# EAGLE design PureRingMod (EAGLE 9.2.2)

## Sheet 1 of 2: Main
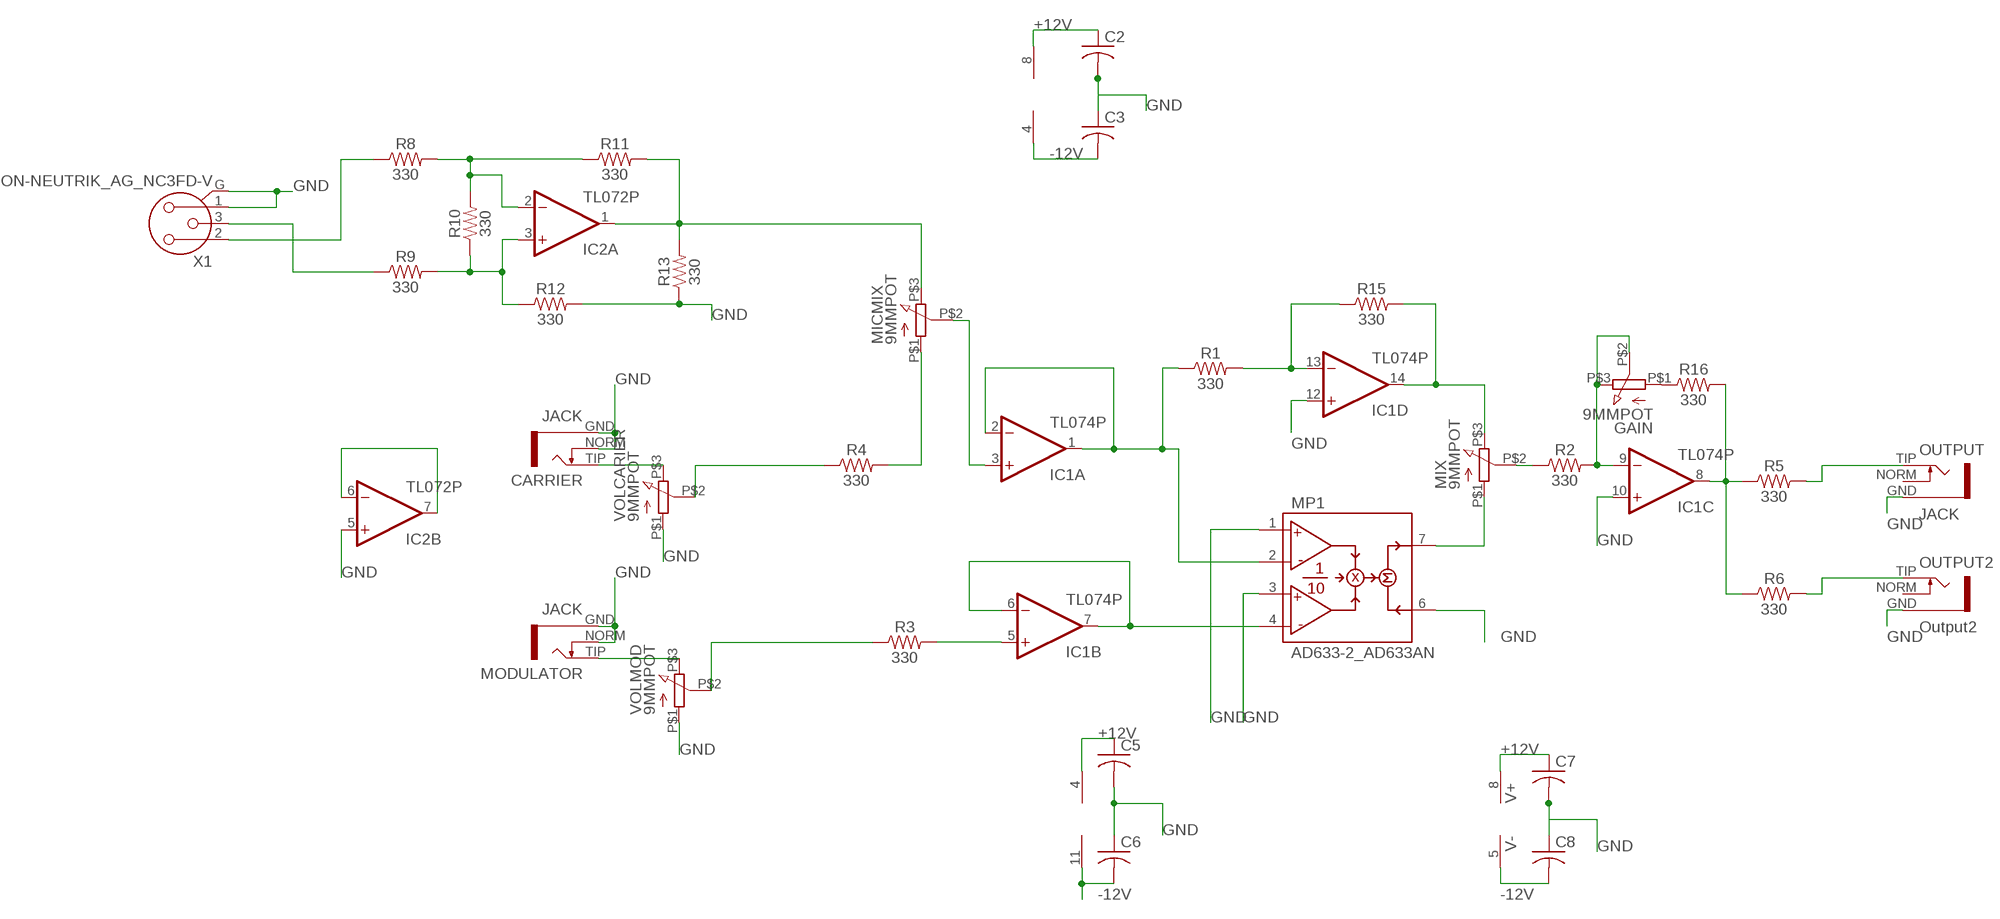
[diagram p0: schematic, sheet 1]

### Parts
C2  CAPACITOR-US050-025X075  [C050-025X075]
C3  CAPACITOR-US050-025X075  [C050-025X075]
C5  CAPACITOR-US050-025X075  [C050-025X075]
C6  CAPACITOR-US050-025X075  [C050-025X075]
C7  CAPACITOR-US050-025X075  [C050-025X075]
C8  CAPACITOR-US050-025X075  [C050-025X075]
CARRIER  JACK  [JACK]
GAIN  9MMPOT  [POT]
IC1  TL074P  [DIL14]
IC2  TL072P  [DIL08]
MICMIX  9MMPOT  [POT]
MIX  9MMPOT  [POT]
MODULATOR  JACK  [JACK]
MP1  AD633-2_AD633AN  [AD633-2_DIL08]
OUTPUT  JACK  [JACK]
OUTPUT2  Output2  JACK  [JACK]
R1  330  330OHM-HORIZ-1/10W-5%  [AXIAL-0.3]
R2  330  330OHM-HORIZ-1/10W-5%  [AXIAL-0.3]
R3  330  330OHM-HORIZ-1/10W-5%  [AXIAL-0.3]
R4  330  330OHM-HORIZ-1/10W-5%  [AXIAL-0.3]
R5  330  330OHM-HORIZ-1/10W-5%  [AXIAL-0.3]
R6  330  330OHM-HORIZ-1/10W-5%  [AXIAL-0.3]
R8  330  330OHM-HORIZ-1/10W-5%  [AXIAL-0.3]
R9  330  330OHM-HORIZ-1/10W-5%  [AXIAL-0.3]
R10  330  330OHM-HORIZ-1/10W-5%  [AXIAL-0.3]
R11  330  330OHM-HORIZ-1/10W-5%  [AXIAL-0.3]
R12  330  330OHM-HORIZ-1/10W-5%  [AXIAL-0.3]
R13  330  330OHM-HORIZ-1/10W-5%  [AXIAL-0.3]
R15  330  330OHM-HORIZ-1/10W-5%  [AXIAL-0.3]
R16  330  330OHM-HORIZ-1/10W-5%  [AXIAL-0.3]
VOLCARIER  9MMPOT  [POT]
VOLMOD  9MMPOT  [POT]
X1  CON-NEUTRIK_AG_NC3FD-V  [CON-NEUTRIK_AG_NC3FD-V]

### Nets
+12V [12V]: C2.1 C5.1 C7.1 IC1.4(P:V+) IC2.8(P:V+) MP1.8(V+) ; also sheet 2
-12V [12V]: C3.2 C6.2 C8.2 IC1.11(P:V-) IC2.4(P:V-) MP1.5(V-) ; also sheet 2
GND [Power]: C2.2 C3.1 C5.2 C6.1 C7.2 C8.1 CARRIER.GND CARRIER.NORM IC1.10(C:+IN) IC1.12(D:+IN) IC2.5(B:+IN) MODULATOR.GND MODULATOR.NORM MP1.1(X1) MP1.3(Y1) MP1.6(Z) OUTPUT2.GND OUTPUT.GND R12.P$2 R13.P$1 VOLCARIER.P$1 VOLMOD.P$1 X1.1 X1.G ; also sheet 2
N$1: IC1.1(A:OUT) IC1.2(A:-IN) MP1.2(X2) R1.P$1
N$2: IC1.6(B:-IN) IC1.7(B:OUT) MP1.4(Y2)
N$3: MIX.P$1 MP1.7(W)
N$4: IC1.14(D:OUT) MIX.P$3 R15.P$2
N$5: GAIN.P$1 R16.P$1
N$6: MIX.P$2 R2.P$1
N$7: GAIN.P$2 GAIN.P$3 IC1.9(C:-IN) R2.P$2
N$8: MICMIX.P$1 R4.P$2
N$11: IC1.5(B:+IN) R3.P$2
N$12: IC1.8(C:OUT) R5.P$1 R6.P$1 R16.P$2
N$13: IC2.6(B:-IN) IC2.7(B:OUT)
N$14: IC1.13(D:-IN) R1.P$2 R15.P$1
N$15: OUTPUT.TIP R5.P$2
N$16: CARRIER.TIP VOLCARIER.P$3
N$17: MODULATOR.TIP VOLMOD.P$3
N$18: R4.P$1 VOLCARIER.P$2
N$19: R3.P$1 VOLMOD.P$2
N$20: OUTPUT2.TIP R6.P$2
N$22: R8.P$1 X1.2
N$23: R9.P$1 X1.3
N$24: IC2.2(A:-IN) R8.P$2 R10.P$2 R11.P$1
N$25: IC2.3(A:+IN) R9.P$2 R10.P$1 R12.P$1
N$27: IC2.1(A:OUT) MICMIX.P$3 R11.P$2 R13.P$2
N$30: IC1.3(A:+IN) MICMIX.P$2
Unconnected: OUTPUT2.NORM OUTPUT.NORM

## Sheet 2 of 2: Power
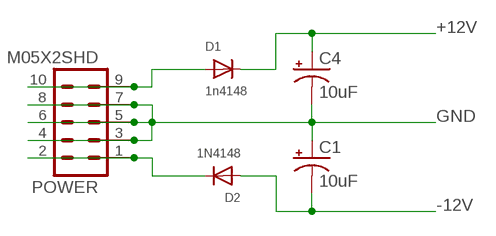
[diagram p1: schematic, sheet 2]

### Parts
C1  10uF  10UF-POLAR-RADIAL-2.5MM-25V-20%  [CPOL-RADIAL-2.5MM-5MM]
C4  10uF  10UF-POLAR-RADIAL-2.5MM-25V-20%  [CPOL-RADIAL-2.5MM-5MM]
D1  1n4148  DIODEDO-1N4148  [DO-1N4148]
D2  1N4148  DIODEDO-1N4148  [DO-1N4148]
POWER  M05X2SHD  [2X5-SHROUDED]

### Nets
+12V [12V]: C4.1(+) D1.C ; also sheet 1
-12V [12V]: C1.2(-) D2.A ; also sheet 1
GND [Power]: C1.1(+) C4.2(-) POWER.3 POWER.4 POWER.5 POWER.6 POWER.7 POWER.8 ; also sheet 1
N$9: D1.A POWER.9 POWER.10
N$10: D2.C POWER.1 POWER.2

## Library data of the parts
C1 C4 = PureRingMod:10UF-POLAR: 10.0µF polarized capacitors A capacitor is a passive two-terminal electrical component used to store electrical energy temporarily in an electric field.; PROD_ID: CAP-08440
C2 C3 C5-C8 = PureRingMod:CAPACITOR-US: Capacitor
CARRIER MODULATOR OUTPUT OUTPUT2 = PureRingMod:JACK
D1 D2 = PureRingMod:DIODE: Diode SMADIODE - SMA Surface Mount Package 20V 1A Schottky Diode Digikey: 641-1014-6-ND DO-1N4148 - Through Hole Small Current Diode SOD-123 20V 1 A (.5mV Vf) Schottky Diode - Digikey: MBRX120TPMSCT-ND SOD-323 10V 570mA (.38mV Vf, 3ns) Schottky Diode - Digikey: ZLLS410CT-ND SOD-523 30V 30mA Schottky Diode (RB751S-40TE61) - Digikey: RB751S-40TE61CT-ND SOT23-R/W - SOT23 Package (R = Solder Paste/Reflow Ovens, W = Hand-Soldering) BAT54Film 40V 300mA - Digikey: 497-7162-1-ND
GAIN MICMIX MIX VOLCARIER VOLMOD = PureRingMod:9MMPOT
IC1 = PureRingMod:TL074: OP AMP
IC2 = PureRingMod:TL072: OP AMP
MP1 = PureRingMod:AD633-2_AD633*
POWER = PureRingMod:M05X2: Header 5x2 Standard 10-pin dual row 0.1" header. Commonly used with AVR-ISP. Use with Spark Fun Electronics SKU: PRT-00778
R1-R6 R8-R13 R15 R16 = PureRingMod:330OHM: 330Ω resistor A resistor is a passive two-terminal electrical component that implements electrical resistance as a circuit element. Resistors act to reduce current flow, and, at the same time, act to lower voltage levels within circuits. - Wikipedia; PROD_ID: RES-8371
X1 = PureRingMod:CON-NEUTRIK_AG_NC3: Neutrik Audio Connector XLR SERIES Stereo 1/4" jack Source: www.neutrik.com/; MF: FARNELL; MPN: NC3FDV; OC_FARNELL: 308869; OC_NEWARK: 07WX7308; RS-PART: 448-244

## Net classes
1 Power: width 0.35 mm
2 12V: width 0.6 mm

## Board
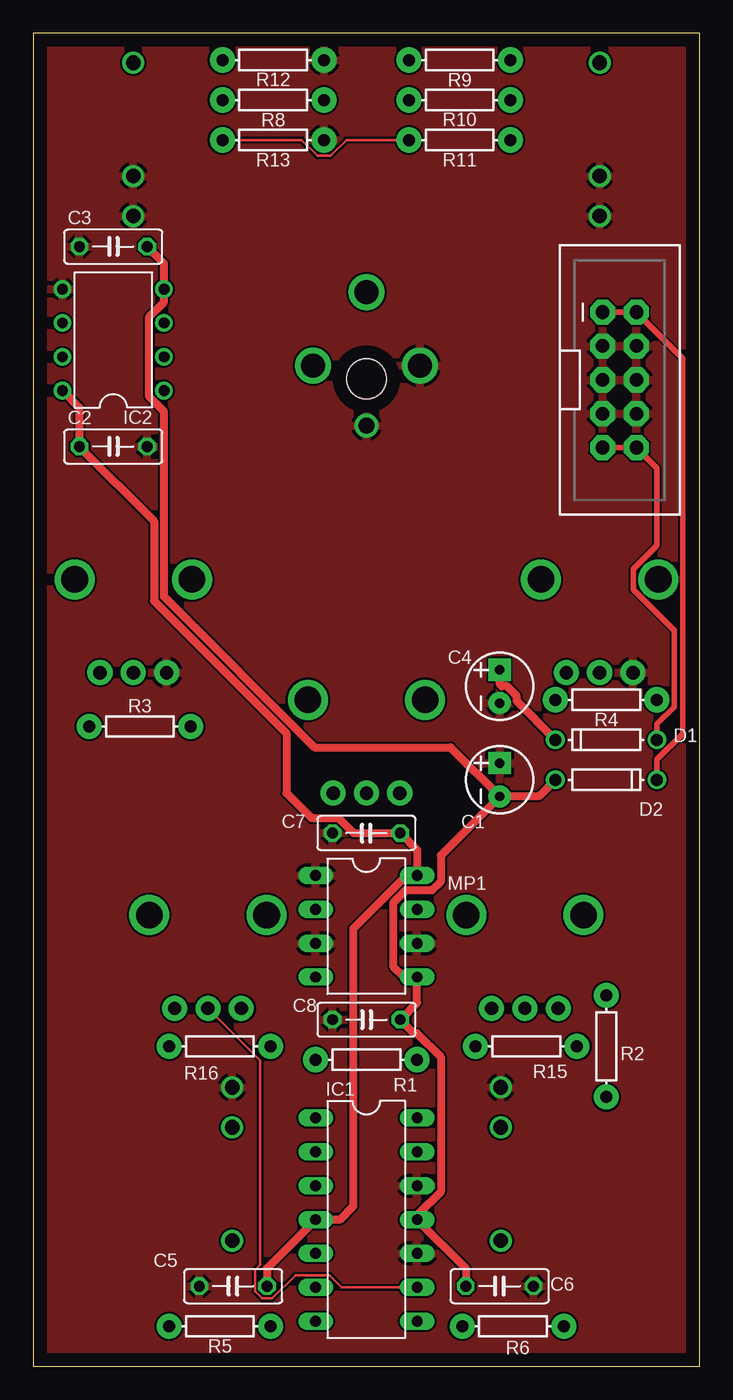
[diagram p2: board, top side]
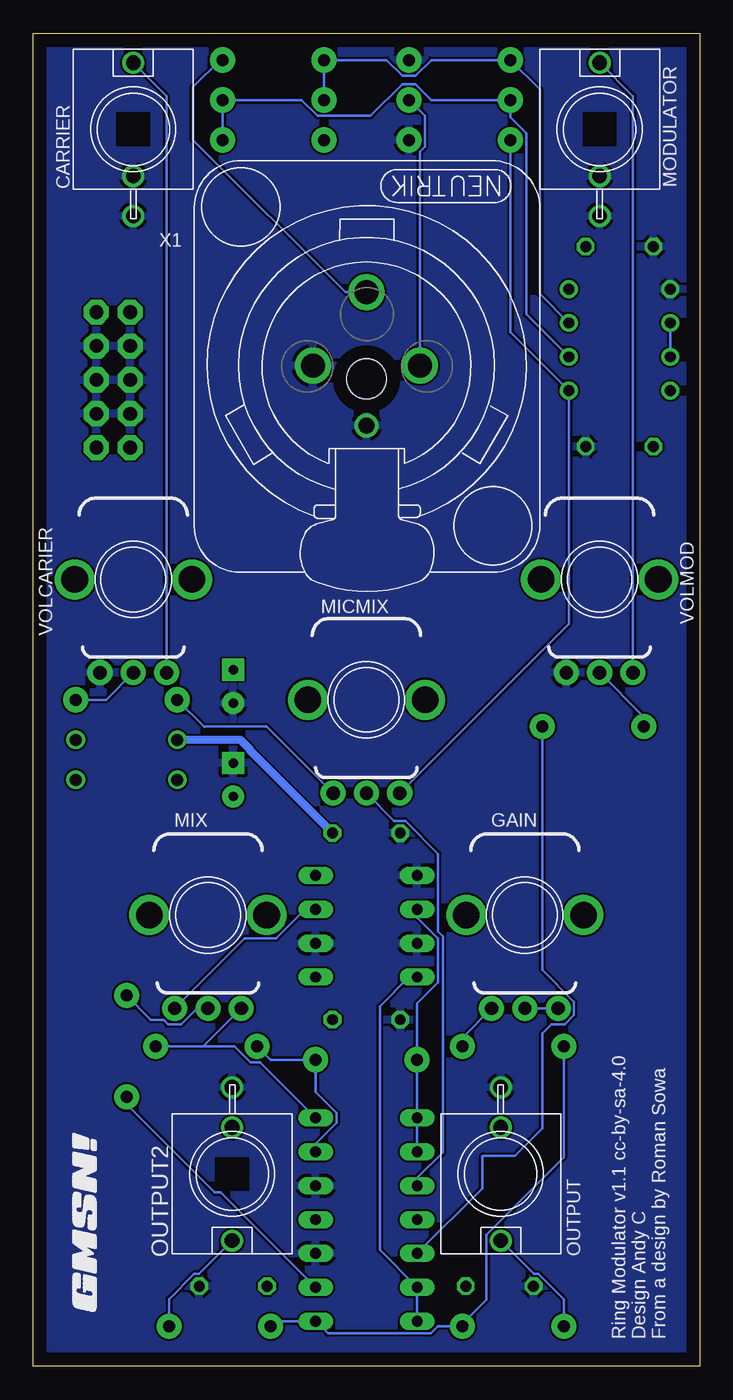
[diagram p3: board, bottom side, seen from below]

Size 50 x 100 mm. Coordinates in mm from the lower left corner, seen from the top.
Outline: 0,100 0,0 50,0 50,100 0,100
Copper layers (1*16): Top 0.035mm / dielectric 1.5mm / Bottom 0.035mm
Design rules "default": minimum track width 6mil, minimum drill 0.35mm, track to track 6mil, track to pad 6mil, pad to pad 6mil, via to via 6mil, smd to smd 6mil, copper to edge 40mil, drill to drill 6mil, minimum pad ring 10mil, minimum via ring 8mil, stop-mask expansion 4mil, vias tented up to drill 0mil, thermal gap 10mil

### Footprints (pad centres in the part's own frame; a part is rotated, then mirrored left to right if it is on the bottom)
CPOL-RADIAL-2.5MM-5MM = drill 0.7 pad 1.651 square: 1 1.25,0 | drill 0.7 pad 1.651: 2 -1.25,0
C050-025X075 = drill 0.813 octagon: 1 -2.54,0; 2 2.54,0
JACK = drill 1.1: GND 0,-6.5; NORM 0,-3.5; TIP 0,5
DO-1N4148 = drill 0.9: A -3.81,0; C 3.81,0
POT = drill 1 pad 1.88: P$1 -2.5,-7; P$2 0,-7; P$3 2.5,-7 | drill 2 pad 2.68: P$4 -4.4,0; P$5 4.4,0
DIL14 = drill 0.813 long: 1 -7.62,-3.81; 2 -5.08,-3.81; 3 -2.54,-3.81; 4 0,-3.81; 5 2.54,-3.81; 6 5.08,-3.81; 7 7.62,-3.81; 8 7.62,3.81; 9 5.08,3.81; 10 2.54,3.81; 11 0,3.81; 12 -2.54,3.81; 13 -5.08,3.81; 14 -7.62,3.81
DIL08 = drill 0.813 pad 1.27: 1 -3.81,-3.81; 2 -1.27,-3.81; 3 1.27,-3.81; 4 3.81,-3.81; 5 3.81,3.81; 6 1.27,3.81; 7 -1.27,3.81; 8 -3.81,3.81
AD633-2_DIL08 = drill 0.813 long: 1 -3.81,-3.81; 2 -1.27,-3.81; 3 1.27,-3.81; 4 3.81,-3.81; 5 3.81,3.81; 6 1.27,3.81; 7 -1.27,3.81; 8 -3.81,3.81
2X5-SHROUDED = drill 1.016 pad 1.88 octagon: 1 -1.27,5.08; 2 1.27,5.08; 3 -1.27,2.54; 4 1.27,2.54; 5 -1.27,0; 6 1.27,0; 7 -1.27,-2.54; 8 1.27,-2.54; 9 -1.27,-5.08; 10 1.27,-5.08
AXIAL-0.3 = drill 0.9 pad 1.88: P$1 -3.81,0; P$2 3.81,0
CON-NEUTRIK_AG_NC3FD-V = drill 1.8: 1 4,0; 2 -4,0; 3 0,-5.5 | drill 1.2: G 0,4.5 | hole 3: 0,1

### Placement (x,y rotation side)
C1  35,44 90 top
C2  6,69 0 top
C3  6,84 0 top
C4  35,51 90 top
C5  15,6 180 top
C6  35,6 180 top
C7  25,40 180 top
C8  25,26 0 top
CARRIER  42.5,92.8 0 bottom
D1  43,47 180 top
D2  43,44 0 top
GAIN  13.11,33.85 0 bottom
IC1  25,11 270 top
IC2  6,77 90 top
MICMIX  25,50 0 bottom
MIX  36.89,33.85 0 bottom
MODULATOR  7.5,92.8 0 bottom
MP1  25,33 270 top
OUTPUT  14.93,14.41 180 bottom
OUTPUT2  35.08,14.41 180 bottom
POWER  44,74 0 top
R1  25,23 0 top
R2  43,24 270 top
R3  8,48 0 top
R4  43,50 180 top
R5  14,3 180 top
R6  36,3 0 top
R8  18,95 180 top
R9  32,98 180 top
R10  32,95 0 top
R11  32,92 180 top
R12  18,98 0 top
R13  18,92 180 top
R15  37,24 0 top
R16  14,24 180 top
U$2  [GMSN!_LOGO]  46.07,11.07 90 bottom
VOLCARIER  42.5,59.03 0 bottom
VOLMOD  7.5,59.03 0 bottom
X1  25,75.06 180 bottom

### Tracks (layer width: path | path; a pad name or v marks a point on that pad's centre or on a via)
+12V
  Top 0.6: C4.1 35,51.19 35.16,51.03 35.53,51.03 36.28,50.28 36.28,49.91 D1.C | IC2.8 3.46,71.92 C2.1 9.06,63.4 9.06,57.42 19,47.48 19,43 20.89,41.11 22.92,41.11 24.03,40 C7.1 28.81,38.73 MP1.8 28.45,36.45 27.64,36.45 24,32.81 24,12 23,11 IC1.4 17.54,7.35 C5.1
  Bottom 0.6: C7.1 33.72,46.18 33.72,46.26 34.46,47 D1.C
-12V
  Top 0.6: D2.A 37.94,42.75 C1.2 | C6.2 32.46,7.35 IC1.11 28.81,11.31 30.58,13.08 30.58,23.2 28.81,24.97 28.57,24.97 C8.2 28.81,27.27 MP1.5 27.81,29.19 27,30 27,34.75 27.95,35.7 29.93,35.7 30.58,36.35 30.58,38.33 C1.2 | C3.2 9.81,82.73 IC2.4 9.81,79.84 8.7,78.73 8.7,72.73 9.81,71.62 9.81,57.73 21.11,46.43 31.32,46.43 C1.2
GND
  pour Bottom: 0,100 50,100 50,0 0,0
  pour Top: 0,100 50,100 50,0 0,0
N$1
  Bottom 0.203: IC1.2 IC1.1 R1.P$1 21.19,27.24 19.61,28.81 19.61,32.11 21.19,33.68 MP1.2
N$2
  Bottom 0.203: IC1.7 IC1.6 24,8.73 24,27 21.81,29.19 MP1.4
N$3
  Bottom 0.203: MP1.7 29.59,34.27 31.76,32.1 34.14,32.1 MIX.P$1
N$4
  Bottom 0.203: MIX.P$3 37.24,24 | 37.24,24 R15.P$2 | IC1.14 33,22.81 33.68,22.81 34.88,24 37.24,24
N$5
  Bottom 0.203: GAIN.P$1 17.81,24.65 R16.P$1
N$6
  Bottom 0.203: MIX.P$2 37.7,26.85 38.9,25.66 39.88,25.66 40.23,26 41.19,26 R2.P$1
N$7
  Top 0.203: GAIN.P$2 17,22.96 17,7.59 16.63,7.22 16.63,5.62 17.16,5.09 17.92,5.09 19.67,6.83 22.23,6.83 23.14,5.92 IC1.9
  Bottom 0.203: IC1.9 35.93,13.04 36.39,13.04 43,19.66 R2.P$2 | GAIN.P$3 GAIN.P$2
N$8
  Bottom 0.203: R4.P$2 37.19,48 32.5,48 MICMIX.P$1
N$9
  Top 0.406: POWER.9 POWER.10 46.81,67.38 46.81,61.57 45.04,59.8 45.04,58.26 48.1,55.2 48.1,49.46 46.81,48.17 D1.A
N$10
  Top 0.406: POWER.1 POWER.2 48.76,75.59 48.76,47.45 46.81,45.5 D2.C
N$11
  Bottom 0.203: IC1.5 16.3,13.35 16.3,15.73 16.24,15.79 13.86,15.79 11.81,17.84 11.81,24.95 11.1,25.66 10.12,25.66 9.42,26.36 9.42,27.34 11.81,29.74 R3.P$2
N$12
  Bottom 0.203: R6.P$1 31.81,3.38 IC1.8 27.9,2.47 20.15,2.47 19.62,3 18,3 | R5.P$1 18,3 | 18,3 16,5 16,9.86 10.19,15.68 R16.P$2
N$13
  Bottom 0.203: IC2.6 IC2.7
N$14
  Bottom 0.203: R15.P$1 32.19,23 R1.P$2 28.81,20.57 27.23,19 27.23,18.24 28.81,16.67 IC1.13
N$15
  Bottom 0.203: OUTPUT.TIP 12.43,6.91 12.08,6.91 10.19,5.02 R5.P$2
N$16
  Bottom 0.203: VOLCARIER.P$3 40,95.3 CARRIER.TIP
N$17
  Bottom 0.203: MODULATOR.TIP 5,95.3 VOLMOD.P$3
N$18
  Bottom 0.203: VOLCARIER.P$2 44.53,50 R4.P$1
N$19
  Bottom 0.203: VOLMOD.P$2 4.19,48.72 R3.P$1
N$20
  Bottom 0.203: 35.3,9.19 OUTPUT2.TIP 37.58,6.91 37.92,6.91 39.81,5.02 R6.P$2
N$22
  Bottom 0.203: X1.2 21,91.12 20.62,91.51 20.62,93.81 R8.P$1
N$23
  Bottom 0.203: X1.3 26.57,80.56 38,92 38,96 36,98 R9.P$1
N$24
  Bottom 0.203: R11.P$1 R10.P$2 29.88,95 28.68,93.81 24.69,93.81 22.3,96.19 21.32,96.19 20.12,95 R8.P$2 14.19,93.69 13,92.49 13,78.92 IC2.2
N$25
  Bottom 0.203: R10.P$1 R9.P$2 23.5,98 22.3,96.81 21.32,96.81 20.12,98 R12.P$1 12,95.81 12,80.46 IC2.3
N$27
  Top 0.203: R11.P$2 23.5,92 22.3,90.81 21.32,90.81 20.12,92 R13.P$2
  Bottom 0.203: R13.P$2 14.19,77.57 IC2.1 9.81,55.69 MICMIX.P$3
N$30
  Bottom 0.203: IC1.3 21.19,14.13 19.26,16.06 19.26,32.26 19.61,32.61 19.61,38.45 22.08,40.91 22.91,40.91 MICMIX.P$2

### Text on the board
bNames: Ring Modulator v1.1 cc-by-sa-4.0 / Design Andy C / From a design by Roman Sowa